# Altium schematic sheet 2505_IDS_DL_BAT.SchDoc
size 299 x 299 mm; SheetNumber: 1; SheetTotal: 1
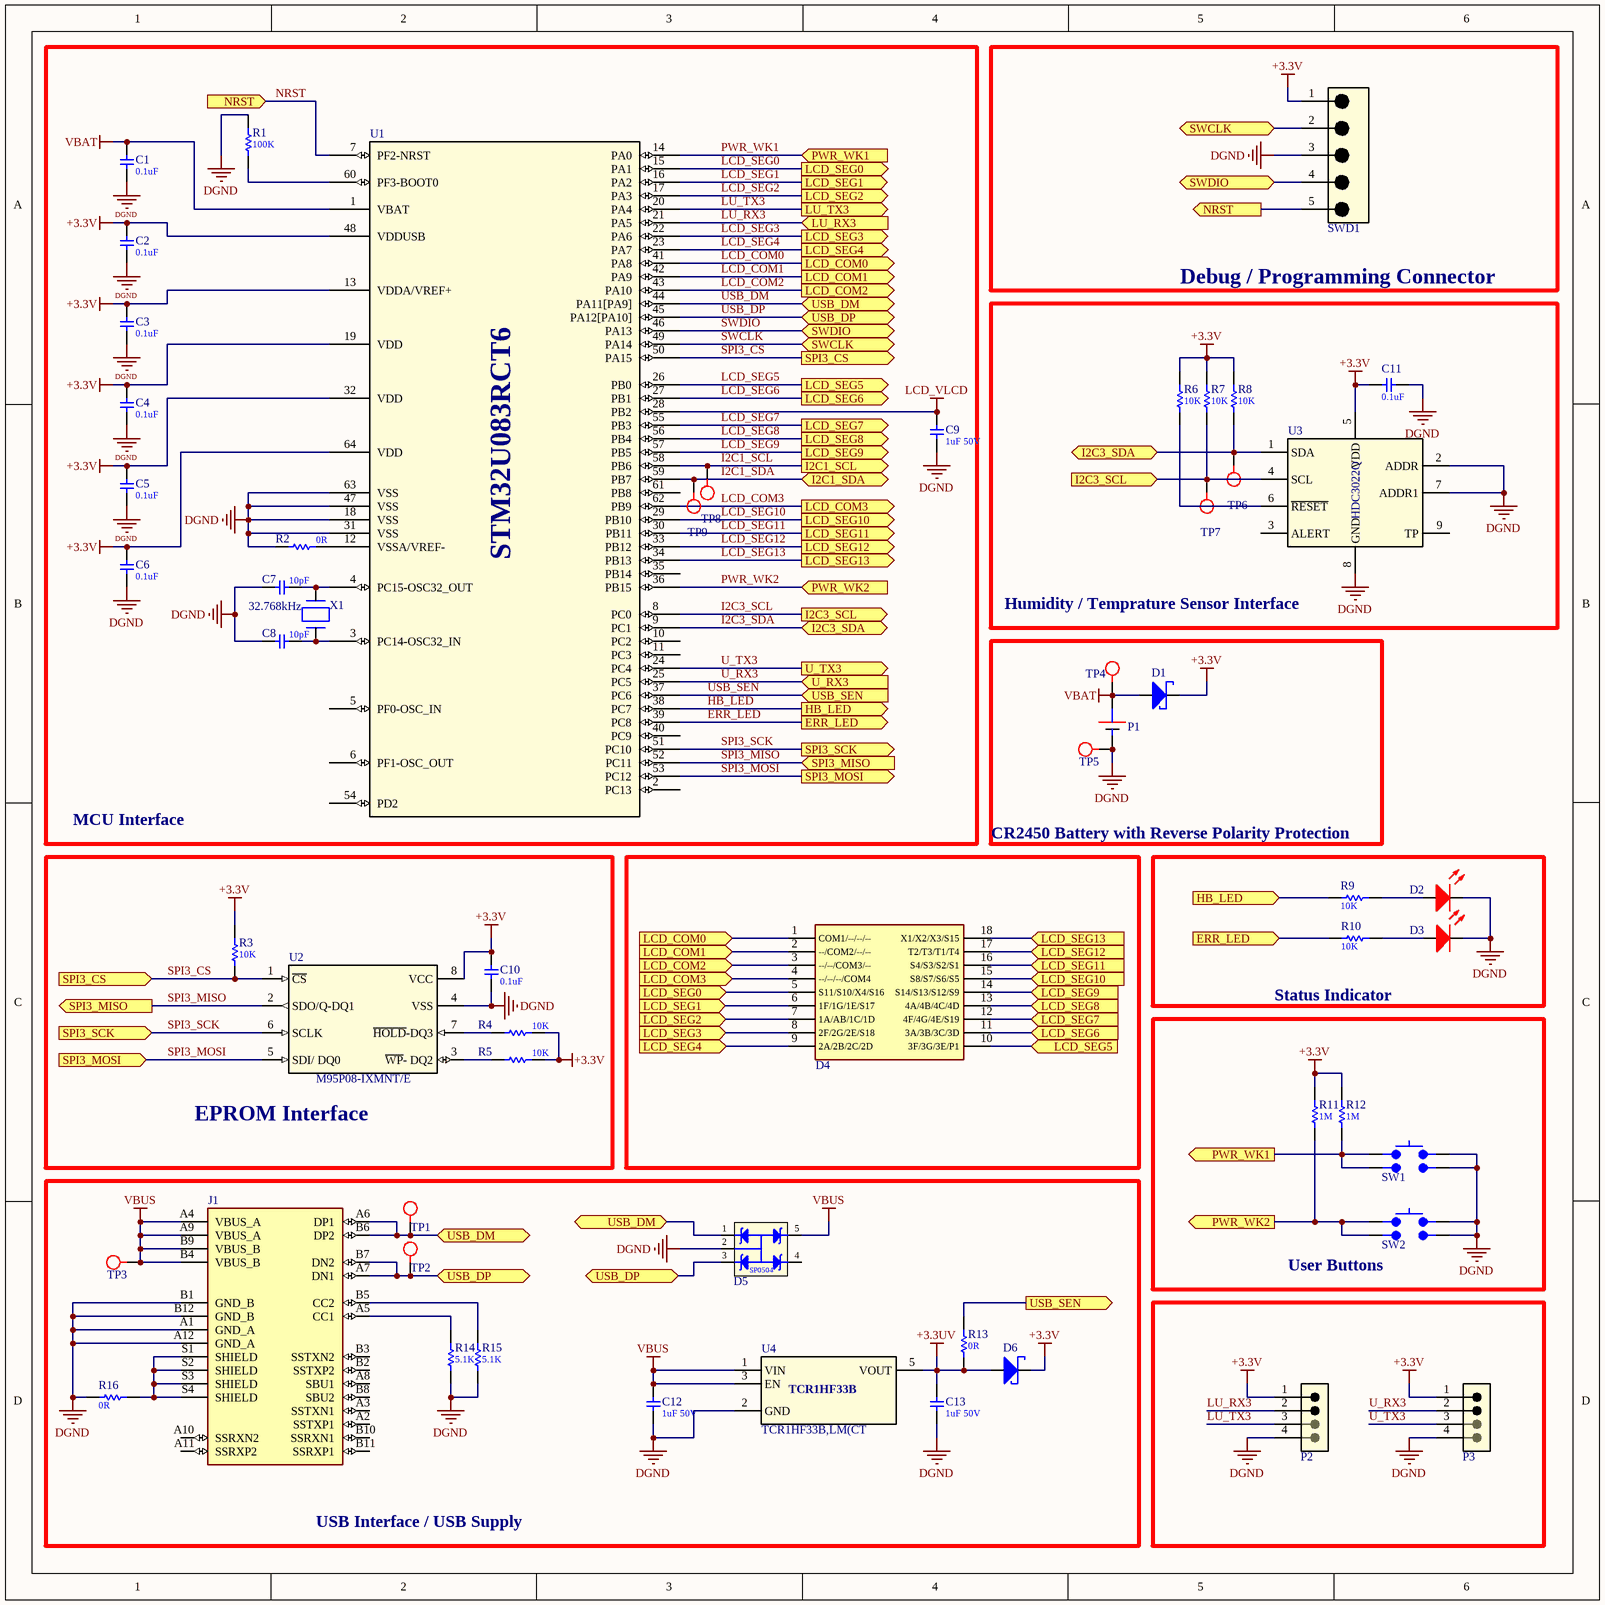
[diagram p0: 2505_IDS_DL_BAT.SchDoc]

## Parts
C1  value 0.1uF  [C_0603 (1608 Metric)]  (hidden comment: CAP CER 0.1UF 50V X7R 0603)
C2  value 0.1uF  [C_0603 (1608 Metric)]  (hidden comment: CAP CER 0.1UF 50V X7R 0603)
C3  value 0.1uF  [C_0603 (1608 Metric)]  (hidden comment: CAP CER 0.1UF 50V X7R 0603)
C4  value 0.1uF  [C_0603 (1608 Metric)]  (hidden comment: CAP CER 0.1UF 50V X7R 0603)
C5  value 0.1uF  [C_0603 (1608 Metric)]  (hidden comment: CAP CER 0.1UF 50V X7R 0603)
C6  value 0.1uF  [C_0603 (1608 Metric)]  (hidden comment: CAP CER 0.1UF 50V X7R 0603)
C7  value 10pF  [C_0603 (1608 Metric)]  (hidden comment: CAP CER 10PF 50V C0G/NP0 0603)
C8  value 10pF  [C_0603 (1608 Metric)]  (hidden comment: CAP CER 10PF 50V C0G/NP0 0603)
C9  value 1uF 50V  [C_0805 (2012 Metric)]  (hidden comment: CAP CER 1UF 50V X7R 0805)
C10  value 0.1uF  [C_0603 (1608 Metric)]  (hidden comment: CAP CER 0.1UF 50V X7R 0603)
C11  value 0.1uF  [C_0603 (1608 Metric)]  (hidden comment: CAP CER 0.1UF 50V X7R 0603)
C12  value 1uF 50V  [C_0805 (2012 Metric)]  (hidden comment: CAP CER 1UF 50V X7R 0805)
C13  value 1uF 50V  [C_0805 (2012 Metric)]  (hidden comment: CAP CER 1UF 50V X7R 0805)
D1  DIODE SCHOTTKY 20V 1A SOD323  [SOD-323]  (value not drawn)
D2  LED RED CLEAR SMD  [L_SMD0805]  (value not drawn)
D3  LED RED CLEAR SMD  [L_SMD0805]  (value not drawn)
D4  LCD_DL_BAT  [LCD_DL_BAT]  (value not drawn)
D5  TVS DIODE 5.5VWM 8.5VC SOT23-5  [SOT-23-5]  (value not drawn)
D6  DIODE SCHOTTKY 20V 1A SOD323  [SOD-323]  (value not drawn)
J1  USB-C REC 3" VERT 24P SMT & TH S  [USB4225-03-1000-C]  (value not drawn)
P1  BAT CLIP CR2477  [BAT_CLIP_CR2477]  (value not drawn)
P2  WR-PHD 1x4 2.00 MM PIN HEADER  [62000411121]  (value not drawn)
P3  WR-PHD 1x4 2.00 MM PIN HEADER  [62000411121]  (value not drawn)
R1  value 100K  [0603 (1608 Metric)]  (hidden comment: RES 100K OHM 1% 1/10W 0603)
R2  value 0R  [0402 (1005 Metric)]  (hidden comment: RES 0 OHM JUMPER - 0402)
R3  value 10K  [0603 (1608 Metric)]  (hidden comment: RES 10K OHM 1% 1/10W 0603)
R4  value 10K  [0603 (1608 Metric)]  (hidden comment: RES 10K OHM 1% 1/10W 0603)
R5  value 10K  [0603 (1608 Metric)]  (hidden comment: RES 10K OHM 1% 1/10W 0603)
R6  value 10K  [0603 (1608 Metric)]  (hidden comment: RES 10K OHM 1% 1/10W 0603)
R7  value 10K  [0603 (1608 Metric)]  (hidden comment: RES 10K OHM 1% 1/10W 0603)
R8  value 10K  [0603 (1608 Metric)]  (hidden comment: RES 10K OHM 1% 1/10W 0603)
R9  value 10K  [0603 (1608 Metric)]  (hidden comment: RES 10K OHM 1% 1/10W 0603)
R10  value 10K  [0603 (1608 Metric)]  (hidden comment: RES 10K OHM 1% 1/10W 0603)
R11  value 1M  [0603 (1608 Metric)]  (hidden comment: RES 1M OHM 1% 1/10W 0603)
R12  value 1M  [0603 (1608 Metric)]  (hidden comment: RES 1M OHM 1% 1/10W 0603)
R13  value 0R  [0402 (1005 Metric)]  (hidden comment: RES 0 OHM JUMPER - 0402)
R14  value 5.1K  [0603 (1608 Metric)]  (hidden comment: RES 5.1K OHM 1% 1/10W 0603)
R15  value 5.1K  [0603 (1608 Metric)]  (hidden comment: RES 5.1K OHM 1% 1/10W 0603)
R16  value 0R  [0402 (1005 Metric)]  (hidden comment: RES 0 OHM JUMPER - 0402)
SW1  SWITCH TACTILE SPST-NO 0.05A 12V  [TL3305AF260QG]  (value not drawn)
SW2  SWITCH TACTILE SPST-NO 0.05A 12V  [TL3305AF260QG]  (value not drawn)
SWD1  CONN HEADER VERT 5POS 2.54MM  [Burg Stick 1x5 2.54mm]  (value not drawn)
TP1  Test Point  [Testpoint 1.02mm PTH]  (value not drawn)
TP2  Test Point  [Testpoint 1.02mm PTH]  (value not drawn)
TP3  Test Point  [Testpoint 1.02mm PTH]  (value not drawn)
TP4  Test Point  [Testpoint 1.02mm PTH]  (value not drawn)
TP5  Test Point  [Testpoint 1.02mm PTH]  (value not drawn)
TP6  Test Point  [Testpoint 1.02mm PTH]  (value not drawn)
TP7  Test Point  [Testpoint 1.02mm PTH]  (value not drawn)
TP8  Test Point SMD  [Test_PointSMD]  (value not drawn)
TP9  Test Point SMD  [Test_PointSMD]  (value not drawn)
U1  value STM32U083RCT6  [64-LQFP]  (hidden comment: IC MCU STM32U083RCT6 64LQFP)
U2  IC EEPROM 8MBIT SPI/QUAD 8SOIC  [8-SOIC (0.154", 3.90mm Width)]  (value not drawn)
U3  RH DIGITAL HUMIDITY SENSOR  [8-LFDFN Exposed Pad]  (value not drawn)
U4  value TCR1HF33B,LM(CT  [SC-74A, SOT-753]  (hidden comment: IC REG LINEAR 3.3V 150MA SMV)
X1  value 32.768kHz  [CRY_NX2012SA_2P]  (hidden comment: CRYSTAL 32.7680KHZ 7PF SMD)

## Blocks framed on the sheet
MCU Interface: C1-C9 R1 R2 TP8 TP9 U1 X1
Debug / Programming Connector: SWD1
Humidity / Temprature Sensor Interface: C11 R6-R8 TP6 TP7 U3
CR2450 Battery with Reverse Polarity Protection: D1 P1 TP4 TP5
EPROM Interface: C10 R3-R5 U2
Status Indicator: D2 D3 R9 R10
User Buttons: R11 R12 SW1 SW2
USB Interface / USB Supply: C12 C13 D5 D6 J1 R13-R16 TP1-TP3 U4

## Ports
ERR_LED (in, see 2505_IDS_DL_BAT[3B]), ERR_LED (out, see 2505_IDS_DL_BAT[5C]), HB_LED (in, see 2505_IDS_DL_BAT[3B]), HB_LED (out, see 2505_IDS_DL_BAT[5C]), I2C1_SCL (out), I2C1_SDA (bidir), I2C3_SCL (in, see 2505_IDS_DL_BAT[3B]), I2C3_SCL (out, see 2505_IDS_DL_BAT[5B]), I2C3_SDA (bidir, see 2505_IDS_DL_BAT[3B]), I2C3_SDA (bidir, see 2505_IDS_DL_BAT[5B]), LCD_COM0 (in, see 2505_IDS_DL_BAT[3A]), LCD_COM0 (out, see 2505_IDS_DL_BAT[3C]), LCD_COM1 (in, see 2505_IDS_DL_BAT[3A]), LCD_COM1 (out, see 2505_IDS_DL_BAT[3C]), LCD_COM2 (in, see 2505_IDS_DL_BAT[3A]), LCD_COM2 (out, see 2505_IDS_DL_BAT[3C]), LCD_COM3 (in, see 2505_IDS_DL_BAT[3B]), LCD_COM3 (out, see 2505_IDS_DL_BAT[3C]), LCD_SEG0 (in, see 2505_IDS_DL_BAT[3A]), LCD_SEG0 (out, see 2505_IDS_DL_BAT[3C]), LCD_SEG1 (in, see 2505_IDS_DL_BAT[3A]), LCD_SEG1 (out, see 2505_IDS_DL_BAT[3C]), LCD_SEG2 (in, see 2505_IDS_DL_BAT[3A]), LCD_SEG2 (out, see 2505_IDS_DL_BAT[3C]), LCD_SEG3 (in, see 2505_IDS_DL_BAT[3A]), LCD_SEG3 (out, see 2505_IDS_DL_BAT[3C]), LCD_SEG4 (in, see 2505_IDS_DL_BAT[3A]), LCD_SEG4 (out, see 2505_IDS_DL_BAT[3C]), LCD_SEG5 (in, see 2505_IDS_DL_BAT[3A]), LCD_SEG5 (out, see 2505_IDS_DL_BAT[4C]), LCD_SEG6 (in, see 2505_IDS_DL_BAT[3A]), LCD_SEG6 (out, see 2505_IDS_DL_BAT[4C]), LCD_SEG7 (in, see 2505_IDS_DL_BAT[3B]), LCD_SEG7 (out, see 2505_IDS_DL_BAT[4C]), LCD_SEG8 (in, see 2505_IDS_DL_BAT[3B]), LCD_SEG8 (out, see 2505_IDS_DL_BAT[4C]), LCD_SEG9 (in, see 2505_IDS_DL_BAT[3B]), LCD_SEG9 (out, see 2505_IDS_DL_BAT[4C]), LCD_SEG10 (in, see 2505_IDS_DL_BAT[3B]), LCD_SEG10 (out, see 2505_IDS_DL_BAT[4C]), LCD_SEG11 (in, see 2505_IDS_DL_BAT[3B]), LCD_SEG11 (out, see 2505_IDS_DL_BAT[4C]), LCD_SEG12 (in, see 2505_IDS_DL_BAT[3B]), LCD_SEG12 (out, see 2505_IDS_DL_BAT[4C]), LCD_SEG13 (in, see 2505_IDS_DL_BAT[3B]), LCD_SEG13 (out, see 2505_IDS_DL_BAT[4C]), LU_RX3 (in), LU_TX3 (out), NRST (in, see 2505_IDS_DL_BAT[5A]), NRST (out, see 2505_IDS_DL_BAT[1A]), PWR_WK1 (in, see 2505_IDS_DL_BAT[5C]), PWR_WK1 (out, see 2505_IDS_DL_BAT[3A]), PWR_WK2 (in, see 2505_IDS_DL_BAT[5D]), PWR_WK2 (out, see 2505_IDS_DL_BAT[3B]), SPI3_CS (in, see 2505_IDS_DL_BAT[3A]), SPI3_CS (out, see 2505_IDS_DL_BAT[1C]), SPI3_MISO (in, see 2505_IDS_DL_BAT[1C]), SPI3_MISO (out, see 2505_IDS_DL_BAT[3B]), SPI3_MOSI (in, see 2505_IDS_DL_BAT[3B]), SPI3_MOSI (out, see 2505_IDS_DL_BAT[1C]), SPI3_SCK (in, see 2505_IDS_DL_BAT[3B]), SPI3_SCK (out, see 2505_IDS_DL_BAT[1C]), SWCLK (bidir, see 2505_IDS_DL_BAT[3A]), SWCLK (bidir, see 2505_IDS_DL_BAT[5A]), SWDIO (bidir, see 2505_IDS_DL_BAT[3A]), SWDIO (bidir, see 2505_IDS_DL_BAT[5A]), U_RX3 (in), U_TX3 (out), USB_DM (bidir, see 2505_IDS_DL_BAT[2D], 2505_IDS_DL_BAT[3A]), USB_DM (bidir, see 2505_IDS_DL_BAT[2D], 2505_IDS_DL_BAT[3D]), USB_DM (bidir, see 2505_IDS_DL_BAT[3A], 2505_IDS_DL_BAT[3D]), USB_DP (bidir, see 2505_IDS_DL_BAT[2D], 2505_IDS_DL_BAT[3A]), USB_DP (bidir, see 2505_IDS_DL_BAT[2D], 2505_IDS_DL_BAT[3D]), USB_DP (bidir, see 2505_IDS_DL_BAT[3A], 2505_IDS_DL_BAT[3D]), USB_SEN (in, see 2505_IDS_DL_BAT[4D]), USB_SEN (out, see 2505_IDS_DL_BAT[3B])

## Nets
+3.3UV: C13.2 D6.2(A) R13.1 U4.5(VOUT)
+3.3V: C2.2 C3.2 C4.2 C5.2 C6.2 C10.1 C11.1 D1.1(K) D6.1(K) P2.1 P3.1 R3.2 R4.2 R5.2 R6.2 R7.2 R8.2 R11.2 R12.2 SWD1.1 U1.13(VDDA/VREF+) U1.19(VDD) U1.32(VDD) U1.48(VDDUSB) U1.64(VDD) U2.8(VCC) U3.5(VDD)
DGND: C1.1 C2.1 C3.1 C4.1 C5.1 C6.1 C7.1 C8.1 C9.1 C10.2 C11.2 C12.1 C13.1 D2.2(K) D3.2(K) D5.2 J1.A1(GND_A) J1.A12(GND_A) J1.B1(GND_B) J1.B12(GND_B) P1.2(-) P2.4 P3.4 R1.2 R2.1 R14.1 R15.1 R16.1 SW1.3 SW1.4 SW2.3 SW2.4 SWD1.3 TP5.1 U1.18(VSS) U1.31(VSS) U1.47(VSS) U1.63(VSS) U2.4(VSS) U3.2(ADDR) U3.7(ADDR1) U3.8(GND) U4.2(GND)
LCD_VLCD: C9.2 U1.28(PB2)
VBAT: C1.2 D1.2(A) P1.1(+) TP4.1 U1.1(VBAT)
VBUS: C12.2 D5.5 J1.A4(VBUS_A) J1.A9(VBUS_A) J1.B4(VBUS_B) J1.B9(VBUS_B) TP3.1 U4.1(VIN) U4.3(EN)
ERR_LED: R10.1 U1.39(PC8) ; port ERR_LED
HB_LED: R9.1 U1.38(PC7) ; port HB_LED
I2C1_SCL: TP8.1 U1.58(PB6) ; port I2C1_SCL
I2C1_SDA: TP9.1 U1.59(PB7) ; port I2C1_SDA
I2C3_SCL: R7.1 TP7.1 U1.8(PC0) U3.4(SCL) ; port I2C3_SCL
I2C3_SDA: R8.1 TP6.1 U1.9(PC1) U3.1(SDA) ; port I2C3_SDA
LCD_COM0: D4.1(COM1/--/--/--) U1.41(PA8) ; port LCD_COM0
LCD_COM1: D4.2(--/COM2/--/--) U1.42(PA9) ; port LCD_COM1
LCD_COM2: D4.3(--/--/COM3/--) U1.43(PA10) ; port LCD_COM2
LCD_COM3: D4.4(--/--/--/COM4) U1.62(PB9) ; port LCD_COM3
LCD_SEG0: D4.5(S11/S10/X4/S16) U1.15(PA1) ; port LCD_SEG0
LCD_SEG1: D4.6(1F/1G/1E/S17) U1.16(PA2) ; port LCD_SEG1
LCD_SEG2: D4.7(1A/AB/1C/1D) U1.17(PA3) ; port LCD_SEG2
LCD_SEG3: D4.8(2F/2G/2E/S18) U1.22(PA6) ; port LCD_SEG3
LCD_SEG4: D4.9(2A/2B/2C/2D) U1.23(PA7) ; port LCD_SEG4
LCD_SEG5: D4.10(3F/3G/3E/P1) U1.26(PB0) ; port LCD_SEG5
LCD_SEG6: D4.11(3A/3B/3C/3D) U1.27(PB1) ; port LCD_SEG6
LCD_SEG7: D4.12(4F/4G/4E/S19) U1.55(PB3) ; port LCD_SEG7
LCD_SEG8: D4.13(4A/4B/4C/4D) U1.56(PB4) ; port LCD_SEG8
LCD_SEG9: D4.14(S14/S13/S12/S9) U1.57(PB5) ; port LCD_SEG9
LCD_SEG10: D4.15(S8/S7/S6/S5) U1.29(PB10) ; port LCD_SEG10
LCD_SEG11: D4.16(S4/S3/S2/S1) U1.30(PB11) ; port LCD_SEG11
LCD_SEG12: D4.17(T2/T3/T1/T4) U1.33(PB12) ; port LCD_SEG12
LCD_SEG13: D4.18(X1/X2/X3/S15) U1.34(PB13) ; port LCD_SEG13
LU_RX3: P2.2 U1.21(PA5) ; port LU_RX3
LU_TX3: P2.3 U1.20(PA4) ; port LU_TX3
NRST: SWD1.5 U1.7(PF2-NRST) ; port NRST
PWR_WK1: R12.1 SW1.1 SW1.2 U1.14(PA0) ; port PWR_WK1
PWR_WK2: R11.1 SW2.1 SW2.2 U1.36(PB15) ; port PWR_WK2
SPI3_CS: R3.1 U1.50(PA15) U2.1(~{CS}) ; port SPI3_CS
SPI3_MISO: U1.52(PC11) U2.2(SDO/Q-DQ1) ; port SPI3_MISO
SPI3_MOSI: U1.53(PC12) U2.5(SDI/_DQ0) ; port SPI3_MOSI
SPI3_SCK: U1.51(PC10) U2.6(SCLK) ; port SPI3_SCK
SWCLK: SWD1.2 U1.49(PA14) ; port SWCLK
SWDIO: SWD1.4 U1.46(PA13) ; port SWDIO
U_RX3: P3.2 U1.25(PC5) ; port U_RX3
U_TX3: P3.3 U1.24(PC4) ; port U_TX3
USB_DM: D5.1 J1.A6(DP1) J1.B6(DP2) TP1.1 U1.44(PA11[PA9]) ; port USB_DM
USB_DP: D5.3 J1.A7(DN1) J1.B7(DN2) TP2.1 U1.45(PA12[PA10]) ; port USB_DP
USB_SEN: R13.2 U1.37(PC6) ; port USB_SEN
NetC7_2: C7.2 U1.4(PC15-OSC32_OUT) X1.2(X2)
NetC8_2: C8.2 U1.3(PC14-OSC32_IN) X1.1(X1)
NetD2_1: D2.1(A) R9.2
NetD3_1: D3.1(A) R10.2
NetJ1_A5: J1.A5(CC1) R14.2
NetJ1_B5: J1.B5(CC2) R15.2
NetJ1_S1: J1.S1(SHIELD) J1.S2(SHIELD) J1.S3(SHIELD) J1.S4(SHIELD) R16.2
NetR1_1: R1.1 U1.60(PF3-BOOT0)
NetR2_2: R2.2 U1.12(VSSA/VREF-)
NetR4_1: R4.1 U2.7(~{HOLD}-DQ3)
NetR5_1: R5.1 U2.3(~{WP}-_DQ2)
NetR6_1: R6.1 U3.6(~{RESET})

Not connected (* = marked no-connect by the designer): D5 4; J1 A2(SSTXP1) A3(SSTXN1) A8(SBU1) A10(SSRXN2) A11(SSRXP2) B2(SSTXP2) B3(SSTXN2) B8(SBU2) B10(SSRXN1) B11(SSRXP1); U1 2(PC13) 5(PF0-OSC_IN) 6(PF1-OSC_OUT) 10(PC2) 11(PC3) 35(PB14) 40(PC9) 54(PD2) 61(PB8); U3 3(ALERT) 9(TP)

## Notes on the sheet
- (in symbol HDC3022QDEJRQ1) HDC3022Q
- (in symbol TCR1HF33B,LM(CT) TCR1HF33B

## Library data of the parts
C1-C6 C10 C11 = CAP CER 0.1UF 50V X7R 0603: Manufacturer Part No: CL10B104KB8NNWC; Manufacturer Name: Samsung Electro-Mechanics; Store ID: VKP-000020; Price@100: 0.61340
C7 C8 = CAP CER 10PF 50V C0G/NP0 0603: Manufacturer Part No: 0603N100J500CT; Manufacturer Name: Walsin Technology Corporation; Store ID: VKP-000057; Price@100: 1.15010
C9 C12 C13 = CAP CER 1UF 50V X7R 0805: Manufacturer Part No: CL21B105KBFNNNE; Manufacturer Name: Samsung Electro-Mechanics; Store ID: VKP-000098; Price@100: 1.36300
D1 D6 = DIODE SCHOTTKY 20V 1A SOD323: Manufacturer Name: Nexperia USA Inc.; Manufacturer Part No: PMEG2010BEA; Store ID: VKP-000013; Price@100: 13.05960
D2 D3 = LED RED CLEAR SMD: Store ID: VKP-000099
D5 = TVS DIODE 5.5VWM 8.5VC SOT23-5: Manufacturer Name: Littelfuse Inc; Manufacturer Part No: SP0504BAHTG; Store ID: VKP-000140; Value: SP0504
J1 = USB-C REC 3" VERT 24P SMT & TH S: Manufacturer Name: Global Connector Technology; Value: USB4225-03-1000-C; Manufacturer Part No: USB4225-03-1000-C; Store ID: *; Price@100: 63.65630
P1 = BAT CLIP CR2477: Manufacturer Name: Takachi; Manufacturer Part No: CST-2450M  /CST-2450P; Store ID: *
P2 P3 = WR-PHD 1x4 2.00 MM PIN HEADER: Manufacturer Name: Würth Elektronik; Manufacturer Part No: 62000411121; Price@100: 18.70770
R1 = RES 100K OHM 1% 1/10W 0603: Manufacturer Part No: RMCF0603FT100K; Manufacturer Name: Stackpole Electronics Inc; Store ID: VKP-000105; Price@100: 0.77520
R2 R13 R16 = RES 0 OHM JUMPER - 0402: Manufacturer Part No: RC0402JR-070RP; Manufacturer Name: YAGEO; Price@100: 0.68710
R3-R10 = RES 10K OHM 1% 1/10W 0603: Manufacturer Part No: RMCF0603FT10K0; Manufacturer Name: Stackpole Electronics Inc; Store ID: VKP-000071; Price@100: 0.77520
R11 R12 = RES 1M OHM 1% 1/10W 0603: Manufacturer Part No: WR06X1004FTL; Manufacturer Name: Walsin Technology Corporation; Price@100: 0.59500
R14 R15 = RES 5.1K OHM 1% 1/10W 0603: Manufacturer Part No: RMCF0603FT5K10; Manufacturer Name: Stackpole Electronics Inc; Store ID: VKP-000113; Price@100: 0.77520
SW1 SW2 = SWITCH TACTILE SPST-NO 0.05A 12V: Manufacturer Name: E-Switch; Value: TL3305AF260QG; Store ID: *; Manufacturer Part No: TL3305AF260QG; Price@100: $0.15850
SWD1 = CONN HEADER VERT 5POS 2.54MM: Manufacturer Name: Würth Elektronik; Manufacturer Part No: 61300511121; Price@100: 0.12690
U1 = STM32U083RCT6: Manufacturer Name: STMicroelectronics; Manufacturer Part No: STM32U083RCT6
U2 = M95P08-IXMNT/E: Manufacturer Name: STMicroelectronics; Manufacturer Part No: M95P08-IXMNT/E; Price@100: 47.58390
U3 = HDC3022QDEJRQ1: Manufacturer Name: Texas Instruments; Manufacturer Part No: HDC3022QDEJRQ1; Store ID: *; Value: HDC3022QDEJRQ1; Price@100: 251.35710
U4 = TCR1HF33B,LM(CT: Manufacturer Name: Toshiba Semiconductor and Storage; Manufacturer Part No: TCR1HF33B,LM(CT; Store ID: *; Price@100: 12.96940
X1 = CRYSTAL 32.7680KHZ 7PF SMD: Manufacturer Name: NDK; Manufacturer Part No: NX2012SA-32.768KHZ-EXS00A-MU00389; ComponentLink1URL: http://tunmcdsvn.tun.st.com/Component_Documentation_Library/Trunk/Crytal_Oscillator/NDK_NX2012SA_Series
TP1-TP7 = Test Point: Store ID: *; Price@100: $1.77
TP8 TP9 = Test Point SMD: Store ID: *; Price@100: $1.77